# EAGLE design sr_motors (EAGLE 7.6.0)
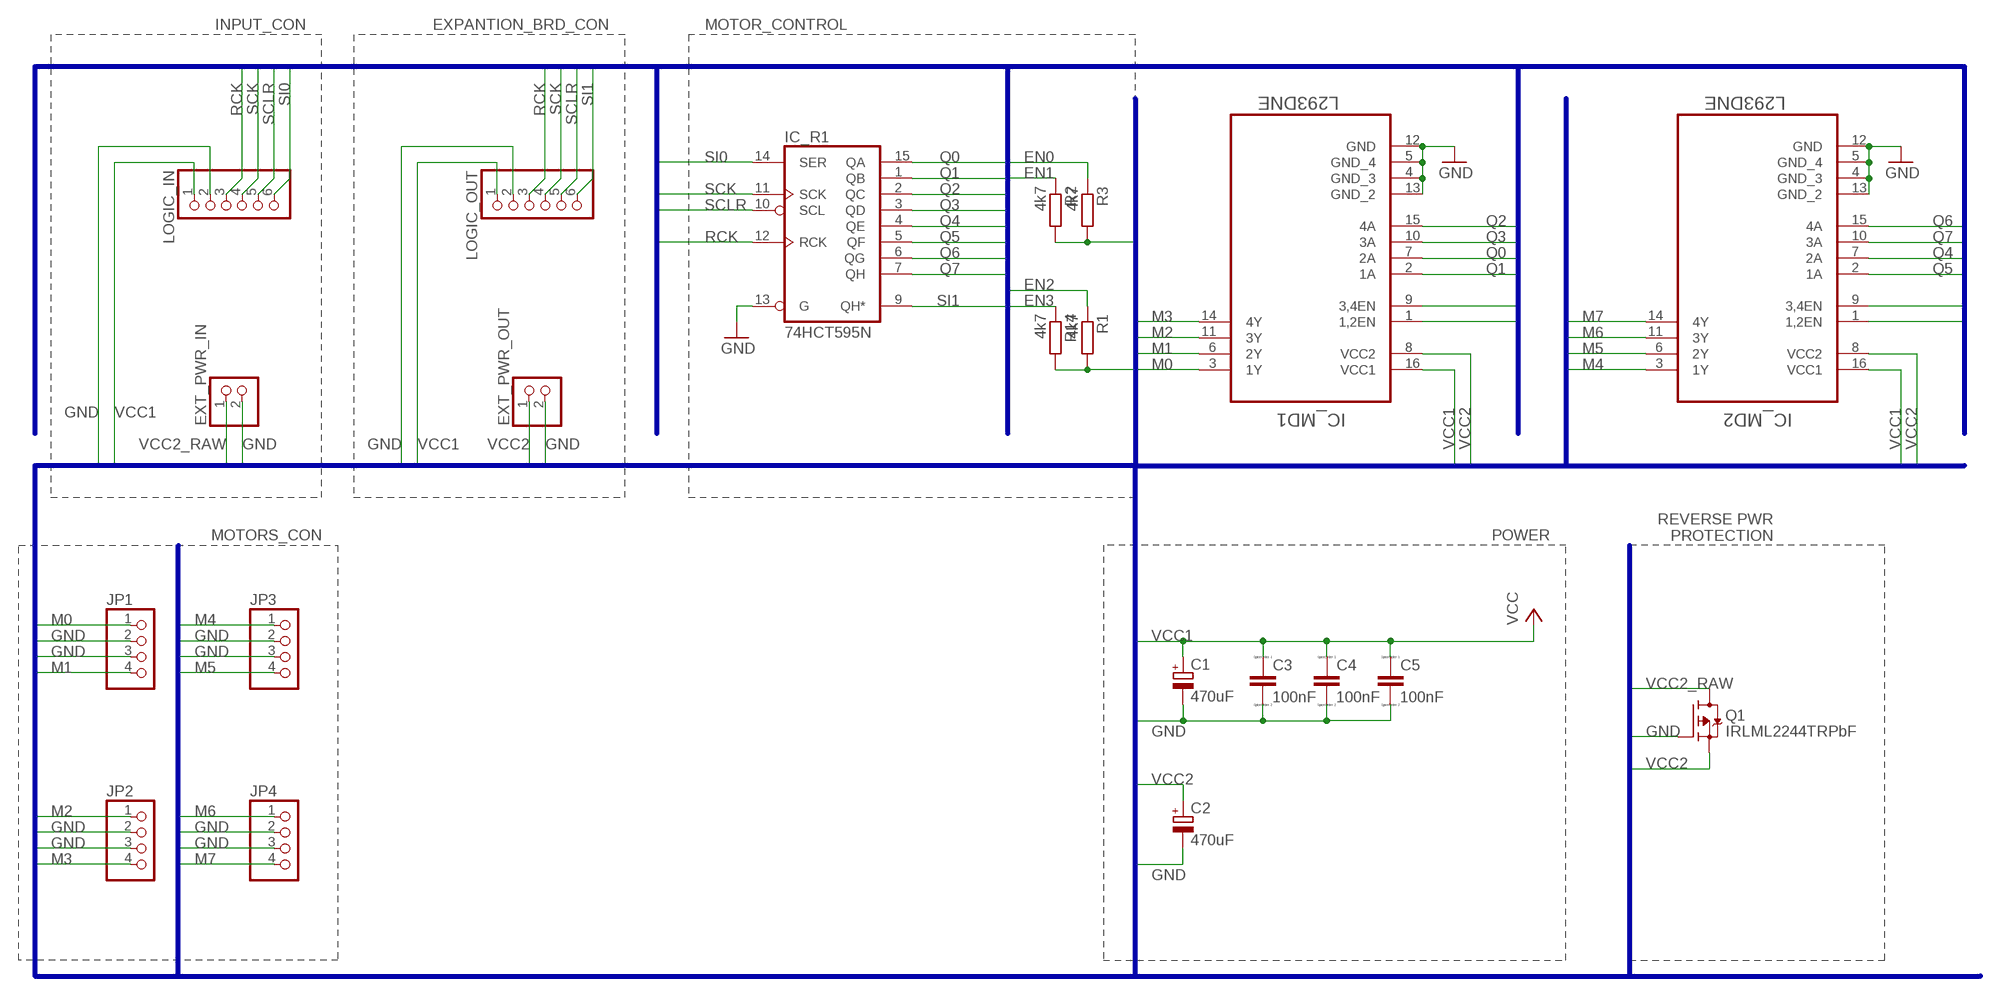
[diagram p0: schematic, sheet 1]

## Parts
C1  470uF  CPOL-EUTT2D6  [TT2D6]
C2  470uF  CPOL-EUTT2D6  [TT2D6]
C3  100nF  C  [C0805]
C4  100nF  C  [C0805]
C5  100nF  C  [C0805]
EXT_PWR_IN  PINHD-1X2  [1X02]
EXT_PWR_OUT  PINHD-1X2  [1X02]
IC_MD1  L293DNE  [DIP254P762X508-16]
IC_MD2  L293DNE  [DIP254P762X508-16]
IC_R1  74HCT595N  [DIL16]
JP1  PINHD-1X4  [1X04]
JP2  PINHD-1X4  [1X04]
JP3  PINHD-1X4  [1X04]
JP4  PINHD-1X4  [1X04]
LOGIC_IN  PINHD-1X6  [1X06]
LOGIC_OUT  PINHD-1X6  [1X06]
Q1  IRLML2244TRPbF  MOSFET-P-SOT23  [SOT23]
R1  4k7  R-EU_M0805  [M0805]
R2  4k7  R-EU_M0805  [M0805]
R3  4k7  R-EU_M0805  [M0805]
R14  4k7  R-EU_M0805  [M0805]

## Nets
EN0: IC_MD1.1(1,2EN) R3.1
EN1: IC_MD1.9(3,4EN) R2.1
EN2: IC_MD2.1(1,2EN) R1.1
EN3: IC_MD2.9(3,4EN) R14.1
GND [power]: C1.- C2.- C3.2 C4.2 C5.2 EXT_PWR_IN.2 EXT_PWR_OUT.2 IC_MD1.4(GND_3) IC_MD1.5(GND_4) IC_MD1.12(GND) IC_MD1.13(GND_2) IC_MD2.4(GND_3) IC_MD2.5(GND_4) IC_MD2.12(GND) IC_MD2.13(GND_2) IC_R1.13(G) JP1.2 JP1.3 JP2.2 JP2.3 JP3.2 JP3.3 JP4.2 JP4.3 LOGIC_IN.2 LOGIC_OUT.2 Q1.1(G)
M0: IC_MD1.3(1Y) JP1.1
M1: IC_MD1.6(2Y) JP1.4
M2: IC_MD1.11(3Y) JP2.1
M3: IC_MD1.14(4Y) JP2.4
M4: IC_MD2.3(1Y) JP3.1
M5: IC_MD2.6(2Y) JP3.4
M6: IC_MD2.11(3Y) JP4.1
M7: IC_MD2.14(4Y) JP4.4
Q0: IC_MD1.7(2A) IC_R1.15(QA)
Q1: IC_MD1.2(1A) IC_R1.1(QB)
Q2: IC_MD1.15(4A) IC_R1.2(QC)
Q3: IC_MD1.10(3A) IC_R1.3(QD)
Q4: IC_MD2.7(2A) IC_R1.4(QE)
Q5: IC_MD2.2(1A) IC_R1.5(QF)
Q6: IC_MD2.15(4A) IC_R1.6(QG)
Q7: IC_MD2.10(3A) IC_R1.7(QH)
RCK: IC_R1.12(RCK) LOGIC_IN.3 LOGIC_OUT.3
SCK: IC_R1.11(SCK) LOGIC_IN.4 LOGIC_OUT.4
SCLR: IC_R1.10(SCL) LOGIC_IN.5 LOGIC_OUT.5
SI0: IC_R1.14(SER) LOGIC_IN.6
SI1: IC_R1.9(QH*) LOGIC_OUT.6
VCC1 [low_power]: C1.+ C3.1 C4.1 C5.1 IC_MD1.16(VCC1) IC_MD2.16(VCC1) LOGIC_IN.1 LOGIC_OUT.1 R1.2 R2.2 R3.2 R14.2 ; supply symbol labelled VCC
VCC2 [power]: C2.+ EXT_PWR_OUT.1 IC_MD1.8(VCC2) IC_MD2.8(VCC2) Q1.2(S)
VCC2_RAW [power]: EXT_PWR_IN.1 Q1.3(D)

## Buses
SR_SIGNAL:RCK,SCLR,SCK,SI[0..1],Q[0..7],EN[0..3]
OUTS:M[0..7],VCC1,VCC2,GND,VCC2_RAW

## Notes on the sheet
- INPUT_CON | EXPANTION_BRD_CON | MOTOR_CONTROL
- REVERSE PWR
  PROTECTION
- MOTORS_CON | POWER

## Power pins joined to a net without a drawn wire
GND: IC_R1.8(GND)
VCC1: IC_R1.16(VCC)

## Library data of the parts
C1 C2 = rcl:CPOL-EU: POLARIZED CAPACITOR, European symbol; KOSMODROM: ECAP-RD-470mkf - 10v
C3-C5 = eagle-ltspice:C: CAPACITOR, European symbol; SPICEMODEL: NONE; SPICEPREFIX: C
EXT_PWR_IN EXT_PWR_OUT = pinhead:PINHD-1X2: PIN HEADER
IC_MD1 IC_MD2 = Texas Instruments_By_element14_Batch_1:L293DNE: QUADRUPLE HALF-H DRIVERS; MPN: L293DNE; OC_FARNELL: 1470423; OC_NEWARK: 06F9523; PACKAGE: PDIP-16; SUPPLIER: Texas Instruments
IC_R1 = 74xx-eu:74*595: 8-bit SHIFT REGISTER, output latch
JP1-JP4 = pinhead:PINHD-1X4: PIN HEADER
LOGIC_IN LOGIC_OUT = pinhead:PINHD-1X6: PIN HEADER
Q1 = we-transistor:MOSFET-P: P-Channel MOSFET (e.g. IRLML6402)
R1-R3 R14 = rcl:R-EU_: RESISTOR, European symbol

## Net classes
1 power: width 1.27 mm
2 low_power: width 1.27 mm

## Board
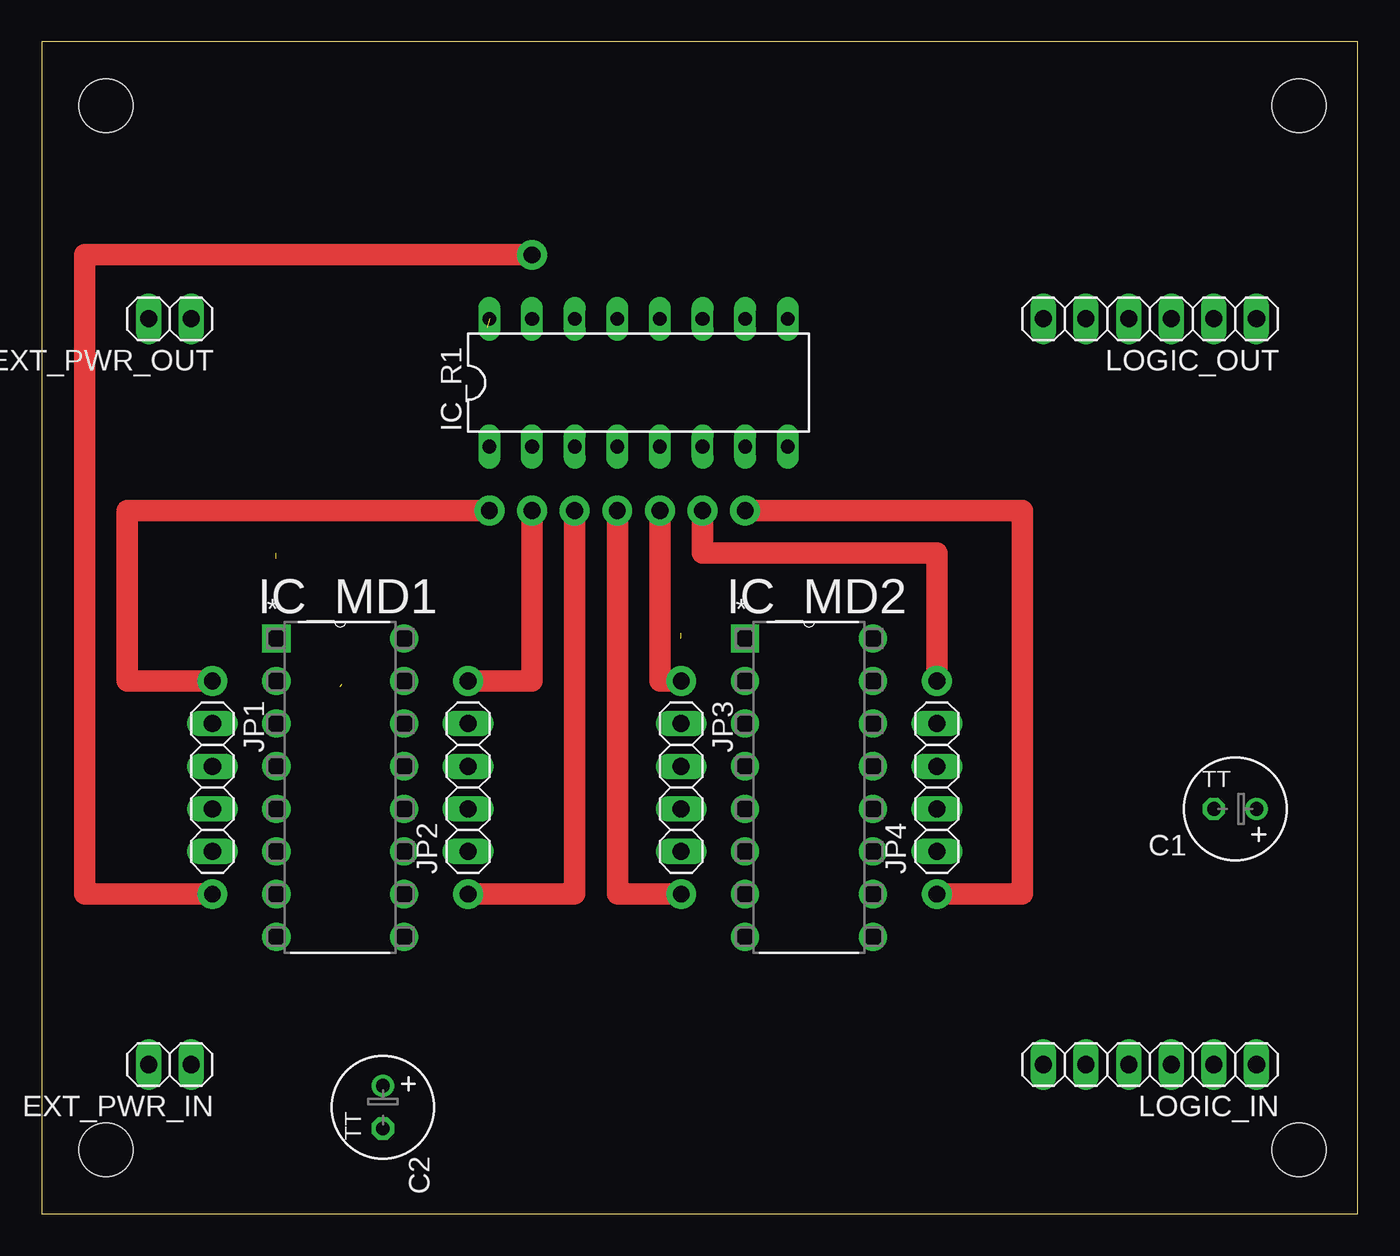
[diagram p1: board, top side]
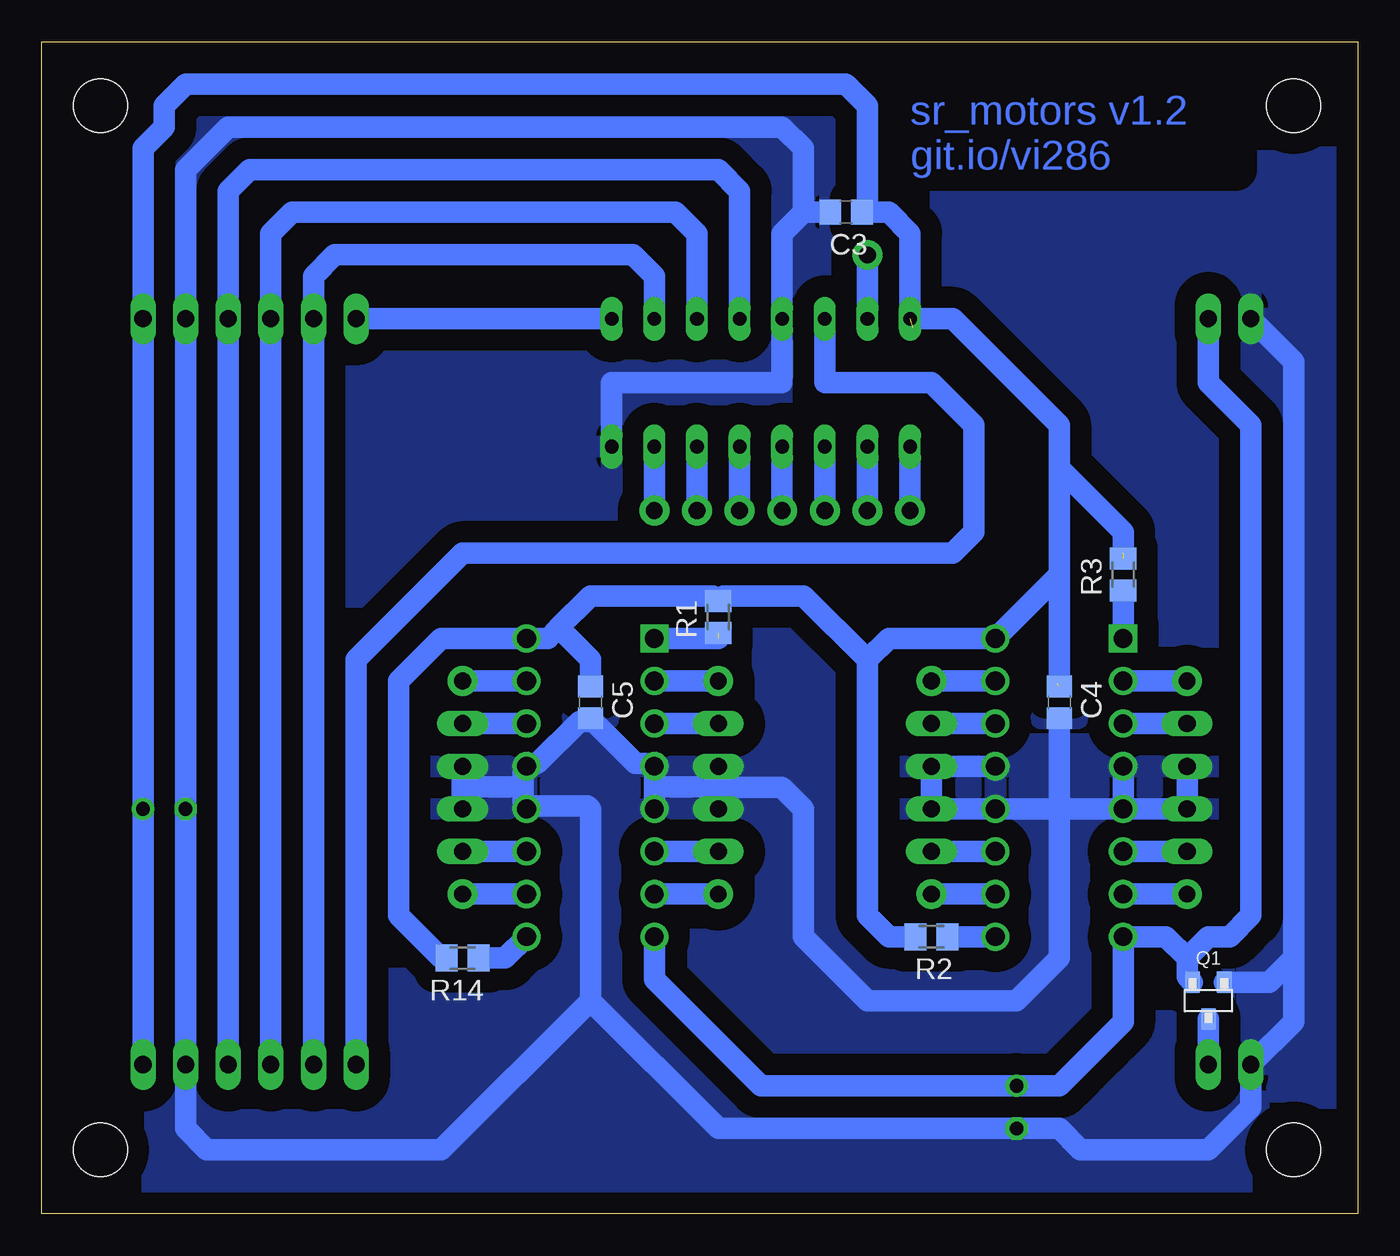
[diagram p2: board, bottom side, seen from below]

Size 78.41 x 69.84 mm. Coordinates in mm from the lower left corner, seen from the top.
Outline: 0,0 78.41,0 78.41,69.84 0,69.84 0,0
Copper layers (1*16): Top 0.035mm / dielectric 1.5mm / Bottom 0.035mm
Design rules "current": minimum track width 20mil, minimum drill 24mil, track to track 24mil, track to pad 24mil, pad to pad 20mil, via to via 20mil, smd to smd 8mil, copper to edge 40mil, drill to drill 13mil, minimum pad ring 10mil, minimum via ring 8mil, stop-mask expansion 4mil, vias tented up to drill 0mil, thermal gap 10mil
Holes 3.2 mm at 74.93,66.04 74.93,3.81 3.81,3.81 3.81,66.04

### Footprints (pad centres in the part's own frame; a part is rotated, then mirrored left to right if it is on the bottom)
TT2D6 = drill 0.813: + -1.27,0 | drill 0.813 octagon: - 1.27,0
C0805 = smd 1.3 x 1.5: 1 -0.95,0; 2 0.95,0
1X02 = drill 1.016 long: 1 -1.27,0; 2 1.27,0
DIP254P762X508-16 = drill 1.118 square: 1 -7.62,17.78 | drill 1.118: 2 -7.62,15.24; 3 -7.62,12.7; 4 -7.62,10.16; 5 -7.62,7.62; 6 -7.62,5.08; 7 -7.62,2.54; 8 -7.62,0; 9 0,0; 10 0,2.54; 11 0,5.08; 12 0,7.62; 13 0,10.16; 14 0,12.7; 15 0,15.24; 16 0,17.78
DIL16 = drill 0.813 long: 1 -8.89,-3.81; 2 -6.35,-3.81; 3 -3.81,-3.81; 4 -1.27,-3.81; 5 1.27,-3.81; 6 3.81,-3.81; 7 6.35,-3.81; 8 8.89,-3.81; 9 8.89,3.81; 10 6.35,3.81; 11 3.81,3.81; 12 1.27,3.81; 13 -1.27,3.81; 14 -3.81,3.81; 15 -6.35,3.81; 16 -8.89,3.81
1X04 = drill 1.016 long: 1 -3.81,0; 2 -1.27,0; 3 1.27,0; 4 3.81,0
1X06 = drill 1.016 long: 1 -6.35,0; 2 -3.81,0; 3 -1.27,0; 4 1.27,0; 5 3.81,0; 6 6.35,0
SOT23 = smd 1.3 x 0.9: 1 -1.1,0.95; 2 -1.1,-0.95; 3 1.1,0
M0805 = smd 1.3 x 1.6: 1 -0.95,0; 2 0.95,0

### Placement (x,y rotation side)
C1  71.12,24.13 180 top
C2  20.32,6.35 270 top
C3  30.48,59.69 180 bottom
C4  17.78,30.48 270 bottom
C5  45.72,30.48 270 bottom
EXT_PWR_IN  7.62,8.89 180 top
EXT_PWR_OUT  7.62,53.34 180 top
IC_MD1  21.59,16.51 0 top
IC_MD2  49.53,16.51 0 top
IC_R1  35.56,49.53 0 top
JP1  10.16,25.4 270 top
JP2  25.4,25.4 90 top
JP3  38.1,25.4 270 top
JP4  53.34,25.4 90 top
LOGIC_IN  66.04,8.89 180 top
LOGIC_OUT  66.04,53.34 180 top
Q1  8.89,12.7 270 bottom
R1  38.1,35.56 90 bottom
R2  25.4,16.51 180 bottom
R3  13.97,38.1 90 bottom
R14  53.34,15.24 180 bottom

### Tracks (layer width: path | path; a pad name or v marks a point on that pad's centre or on a via)
EN0
  Bottom 1.27: IC_MD1.1 R3.1
EN1
  Bottom 1.27: IC_MD1.9 R2.1
EN2  (1 unrouted)
  Bottom 1.27: IC_MD2.1 38.1,34.29
EN3
  Bottom 1.27: IC_MD2.9 50.8,15.24 R14.1
GND
  Bottom 1.27: C3.2 33.02,59.69 | 33.02,59.69 34.29,58.42 IC_R1.13 34.29,49.53 44.45,49.53 IC_R1.8 | EXT_PWR_OUT.2 3.81,50.8 3.81,15.24 | IC_MD1.4 IC_MD1.5 | 38,25.43 38,26.54 JP3.2 | 38,25.43 38,24.31 JP3.3 | 41.91,25.43 IC_MD2.4 42.47,26.82 43.03,26.82 45.26,29.06 C5.2 45.82,29.34 46.38,29.34 48.9,26.82 49.45,26.82 IC_MD2.13 49.73,26.26 49.73,25.43 | 41.91,25.43 IC_MD2.5 | 41.91,25.43 38,25.43 | 53.37,25.43 53.37,26.54 JP4.3 | 53.37,25.43 53.37,24.31 JP4.2 | 49.73,25.43 49.73,24.31 45.9,24.31 45.72,24.13 45.72,12.7 | 49.73,25.43 53.37,25.43 | 45.72,12.7 38.1,5.08 C2.- 17.78,5.08 16.51,3.81 8.89,3.81 6.35,6.35 EXT_PWR_IN.2 3.81,11.43 3.81,15.24 | 17.78,24.13 IC_MD1.12 JP2.2 JP2.3 IC_MD1.13 | 17.78,24.13 IC_MD1.5 | IC_MD1.5 JP1.3 JP1.2 | 17.78,24.13 17.78,15.24 20.32,12.7 29.21,12.7 33.02,16.51 33.02,24.13 34.29,25.4 37.97,25.4 38,25.43 | C4.2 17.78,24.13 | Q1.1 5.25,13.8 3.81,15.24 | 33.02,59.69 33.02,63.5 34.29,64.77 67.31,64.77 69.85,62.23 LOGIC_OUT.2 C1.- LOGIC_IN.2 69.85,5.08 68.58,3.81 54.61,3.81 45.72,12.7
  pour Bottom (isolate 1.27): 0,69.85 78.74,69.85 78.74,0 0,0
M0
  Bottom 1.27: JP1.1 IC_MD1.3
M1
  Bottom 1.27: IC_MD1.6 JP1.4
M2
  Bottom 1.27: IC_MD1.11 JP2.1
M3
  Bottom 1.27: IC_MD1.14 JP2.4
M4
  Bottom 1.27: IC_MD2.3 JP3.1
M5
  Bottom 1.27: JP3.4 IC_MD2.6
M6
  Bottom 1.27: IC_MD2.11 JP4.1
M7
  Bottom 1.27: IC_MD2.14 JP4.4
Q0  (via drill 1 pad 1.78)
  Top 1.27: v29.21,57.15 2.54,57.15 2.54,19.05 v10.16,19.05
  Bottom 1.27: v10.16,19.05 IC_MD1.7 | IC_R1.15 v29.21,57.15
Q1  (via drill 1 pad 1.78)
  Top 1.27: v10.16,31.75 5.08,31.75 5.08,41.91 v26.67,41.91
  Bottom 1.27: v10.16,31.75 IC_MD1.2 | IC_R1.1 v26.67,41.91
Q2  (via drill 1 pad 1.78)
  Top 1.27: v29.21,41.91 29.21,31.75 v25.4,31.75
  Bottom 1.27: IC_MD1.15 v25.4,31.75 | v29.21,41.91 IC_R1.2
Q3  (via drill 1 pad 1.78)
  Top 1.27: v25.4,19.05 31.75,19.05 v31.75,41.91
  Bottom 1.27: IC_MD1.10 v25.4,19.05 | IC_R1.3 v31.75,41.91
Q4  (via drill 1 pad 1.78)
  Top 1.27: v34.29,41.91 34.29,19.05 v38.1,19.05
  Bottom 1.27: IC_MD2.7 v38.1,19.05 | IC_R1.4 v34.29,41.91
Q5  (via drill 1 pad 1.78)
  Top 1.27: v36.83,41.91 36.83,31.75 v38.1,31.75
  Bottom 1.27: v38.1,31.75 IC_MD2.2 | IC_R1.5 v36.83,41.91
Q6  (via drill 1 pad 1.78)
  Top 1.27: v39.37,41.91 39.37,39.37 53.34,39.37 v53.34,31.75
  Bottom 1.27: IC_MD2.15 v53.34,31.75 | IC_R1.6 v39.37,41.91
Q7  (via drill 1 pad 1.78)
  Top 1.27: v41.91,41.91 58.42,41.91 58.42,19.05 v53.34,19.05
  Bottom 1.27: IC_MD2.10 v53.34,19.05 | IC_R1.7 v41.91,41.91
RCK
  Bottom 1.27: LOGIC_IN.3 LOGIC_OUT.3 67.31,60.96 66.04,62.23 38.1,62.23 36.83,60.96 IC_R1.12
SCK
  Bottom 1.27: LOGIC_IN.4 LOGIC_OUT.4 64.77,58.42 63.5,59.69 40.64,59.69 39.37,58.42 IC_R1.11
SCLR
  Bottom 1.27: LOGIC_IN.5 LOGIC_OUT.5 62.23,55.88 60.96,57.15 43.18,57.15 41.91,55.88 IC_R1.10
SI0
  Bottom 1.27: IC_R1.14 31.75,49.53 25.4,49.53 22.86,46.99 22.86,40.64 24.13,39.37 53.34,39.37 59.69,33.02 LOGIC_IN.6
SI1
  Bottom 1.27: LOGIC_OUT.6 IC_R1.9
VCC1  (3 unrouted)
  Bottom 0.508: 26.54,52.68 26.54,52.81
  Bottom 1.27: LOGIC_IN.1 C1.+ LOGIC_OUT.1 72.39,63.5 71.12,64.77 71.12,66.04 69.85,67.31 30.48,67.31 29.21,66.04 29.21,60.01 C3.1 27.94,59.69 26.67,58.42 IC_R1.16 24.13,53.34 17.78,46.99 17.78,44.45 | 17.88,31.57 17.78,31.67 17.78,38.1 | 17.78,44.45 17.78,38.1 | 29.21,33.02 33.02,36.83 37.78,36.83 R1.2 38.42,36.83 45.72,36.83 47.62,34.92 | 29.21,33.02 29.21,17.78 27.94,16.51 R2.2 | 29.21,33.02 27.94,34.29 IC_MD1.16 17.78,38.1 | 47.62,34.92 48.26,34.29 IC_MD2.16 54.61,34.29 57.15,31.75 57.15,17.78 54.61,15.24 R14.2 | C5.1 45.72,33.02 47.62,34.92 | 13.97,39.37 13.97,40.64 17.78,44.45
VCC2
  Bottom 1.27: EXT_PWR_OUT.1 8.89,49.53 6.35,46.99 6.35,17.78 7.62,16.51 8.89,16.51 10.16,15.24 | 10.16,15.24 10.16,14.12 Q1.2 | 10.16,15.24 11.43,16.51 IC_MD1.8 13.97,11.43 17.78,7.62 C2.+ 35.56,7.62 41.91,13.97 IC_MD2.8
VCC2_RAW
  Bottom 1.27: Q1.3 EXT_PWR_IN.1

### Text on the board
Bottom: sr_motors v1.2 / git.io/vi286